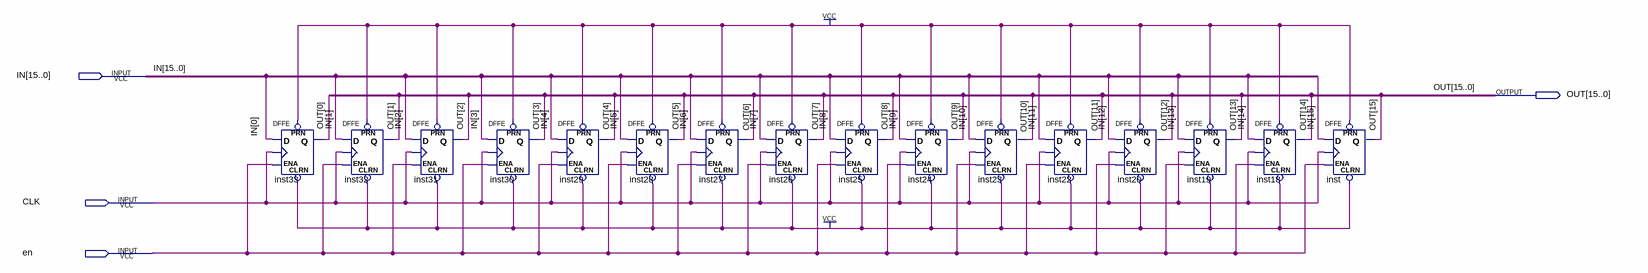
[diagram p0: schematic sheet]
// Quartus schematic 16bitRegEn.bdf as structural Verilog: 16 symbols, 4 pins
module \16bitRegEn  (
  input  [15:0] IN,
  input  CLK,
  input  en,
  output [15:0] OUT
);

  DFFE inst33 (.PRN(1'b1), .CLRN(1'b1), .D(IN[0]), .CLK(CLK), .ENA(en), .Q(OUT[0]));
  DFFE inst32 (.PRN(1'b1), .CLRN(1'b1), .D(IN[1]), .CLK(CLK), .ENA(en), .Q(OUT[1]));
  DFFE inst31 (.PRN(1'b1), .CLRN(1'b1), .D(IN[2]), .CLK(CLK), .ENA(en), .Q(OUT[2]));
  DFFE inst30 (.PRN(1'b1), .CLRN(1'b1), .D(IN[3]), .CLK(CLK), .ENA(en), .Q(OUT[3]));
  DFFE inst29 (.PRN(1'b1), .CLRN(1'b1), .D(IN[4]), .CLK(CLK), .ENA(en), .Q(OUT[4]));
  DFFE inst28 (.PRN(1'b1), .CLRN(1'b1), .D(IN[5]), .CLK(CLK), .ENA(en), .Q(OUT[5]));
  DFFE inst27 (.PRN(1'b1), .CLRN(1'b1), .D(IN[6]), .CLK(CLK), .ENA(en), .Q(OUT[6]));
  DFFE inst26 (.PRN(1'b1), .CLRN(1'b1), .D(IN[7]), .CLK(CLK), .ENA(en), .Q(OUT[7]));
  DFFE inst25 (.PRN(1'b1), .CLRN(1'b1), .D(IN[8]), .CLK(CLK), .ENA(en), .Q(OUT[8]));
  DFFE inst24 (.PRN(1'b1), .CLRN(1'b1), .D(IN[9]), .CLK(CLK), .ENA(en), .Q(OUT[9]));
  DFFE inst23 (.PRN(1'b1), .CLRN(1'b1), .D(IN[10]), .CLK(CLK), .ENA(en), .Q(OUT[10]));
  DFFE inst22 (.PRN(1'b1), .CLRN(1'b1), .D(IN[11]), .CLK(CLK), .ENA(en), .Q(OUT[11]));
  DFFE inst20 (.PRN(1'b1), .CLRN(1'b1), .D(IN[12]), .CLK(CLK), .ENA(en), .Q(OUT[12]));
  DFFE inst19 (.PRN(1'b1), .CLRN(1'b1), .D(IN[13]), .CLK(CLK), .ENA(en), .Q(OUT[13]));
  DFFE inst18 (.PRN(1'b1), .CLRN(1'b1), .D(IN[14]), .CLK(CLK), .ENA(en), .Q(OUT[14]));
  DFFE inst (.PRN(1'b1), .CLRN(1'b1), .D(IN[15]), .CLK(CLK), .ENA(en), .Q(OUT[15]));
endmodule
